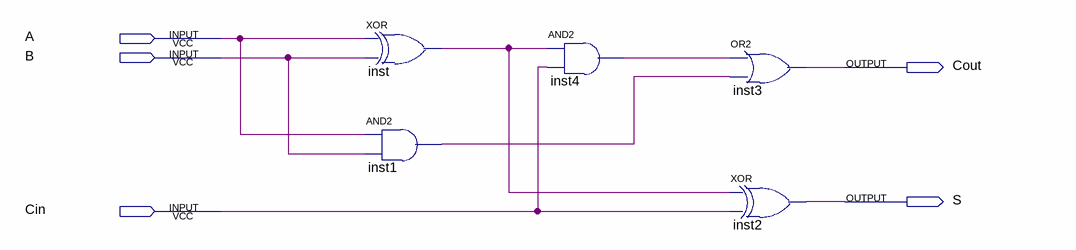
[diagram p0: schematic sheet]
// Quartus schematic somador.bdf as structural Verilog: 5 symbols, 5 pins
module somador (
  input  A,
  input  B,
  input  Cin,
  output Cout,
  output S
);

  wire inst1_out, inst4_out, inst_out;

  xor inst (inst_out, A, B);
  and inst1 (inst1_out, A, B);
  and inst4 (inst4_out, inst_out, Cin);
  or inst3 (Cout, inst4_out, inst1_out);
  xor inst2 (S, inst_out, Cin);
endmodule
